# Altium schematic sheet Salida.SchDoc
size A4
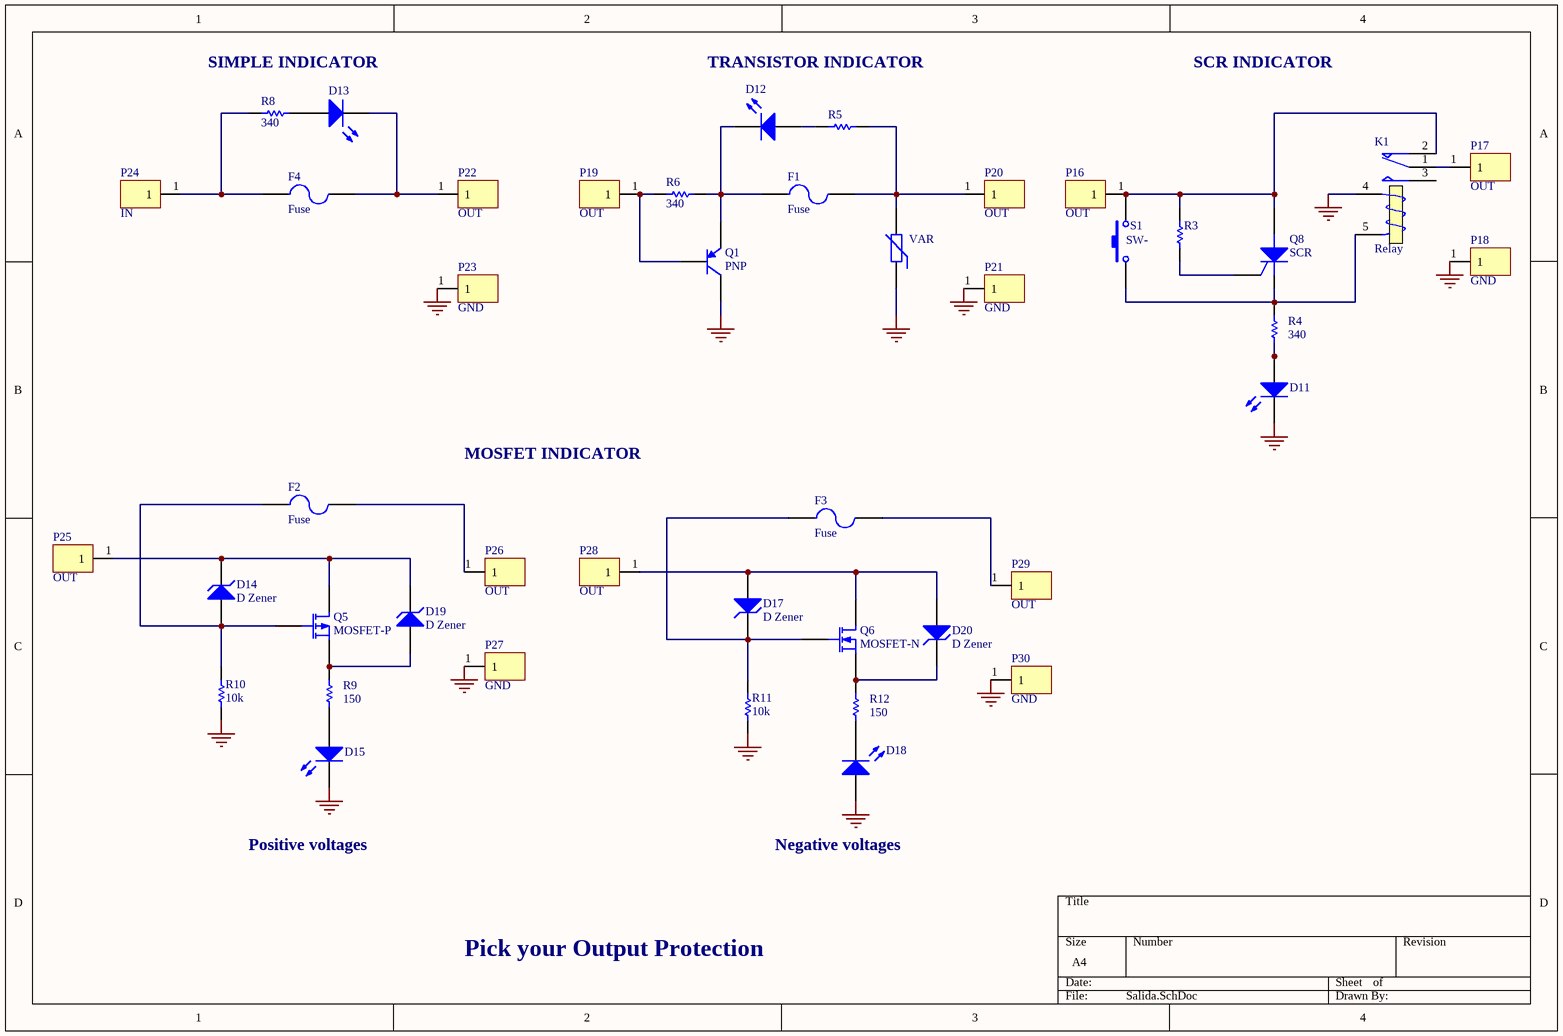
[diagram p0: Salida.SchDoc]

## Parts
D11  LED0  [LED-0]  (value not drawn)
D12  LED0  [LED-0]  (value not drawn)
D13  LED0  [LED-0]  (value not drawn)
D14  D Zener  [DIODE-0.7]
D15  LED0  [LED-0]  (value not drawn)
D17  D Zener  [DIODE-0.7]
D18  LED0  [LED-0]  (value not drawn)
D19  D Zener  [DIODE-0.7]
D20  D Zener  [DIODE-0.7]
F1  Fuse  [PIN-W2/E2.8]
F2  Fuse  [PIN-W2/E2.8]
F3  Fuse  [PIN-W2/E2.8]
F4  Fuse  [PIN-W2/E2.8]
K1  Relay  [MODULE5B]
P16  OUT  [cONECTOR]
P17  OUT  [cONECTOR]
P18  GND  [cONECTOR]
P19  OUT  [cONECTOR]
P20  OUT  [cONECTOR]
P21  GND  [cONECTOR]
P22  OUT  [cONECTOR]
P23  GND  [cONECTOR]
P24  IN  [cONECTOR]
P25  OUT  [cONECTOR]
P26  OUT  [cONECTOR]
P27  GND  [cONECTOR]
P28  OUT  [cONECTOR]
P29  OUT  [cONECTOR]
P30  GND  [cONECTOR]
Q1  PNP  [SOT-23B_N]
Q5  MOSFET-P  [E3]
Q6  MOSFET-N  [E3]
Q8  SCR  [TO-220-AB]
R3  Res1  [AXIAL-0.3]  (value not drawn)
R4  340  [AXIAL-0.3]
R5  340  [AXIAL-0.3]  (value not drawn)
R6  340  [AXIAL-0.3]
R8  340  [AXIAL-0.3]
R9  150  [AXIAL-0.3]
R10  10k  [AXIAL-0.3]
R11  10k  [AXIAL-0.3]
R12  150  [AXIAL-0.3]
S1  SW-  [SPST-2]
VAR  Res Varistor  [6-0805_N]  (value not drawn)

## Nets
GND: D11.2(K) D15.2(K) D18.1(A) K1.4(T1) P18.1 P21.1 P23.1 P27.1 P30.1 Q1.1(C) R10.1 R11.1 VAR.1
NetD11_1: D11.1(A) R4.1
NetD12_1: D12.1(A) R5.1
NetD12_2: D12.2(K) F1.1 Q1.3(E) R6.2
NetD13_1: D13.1(A) R8.1
NetD13_2: D13.2(K) F4.2 P22.1
NetD14_1: D14.1(A) F2.1 Q5.2(G) R10.2
NetD14_2: D14.2(K) D19.2(K) P25.1 Q5.1(D)
NetD15_1: D15.1(A) R9.1
NetD17_1: D17.1(A) D20.1(A) P28.1 Q6.1(D)
NetD17_2: D17.2(K) F3.1 Q6.2(G) R11.2
NetD18_2: D18.2(K) R12.1
NetD19_1: D19.1(A) Q5.3(S) R9.2
NetD20_2: D20.2(K) Q6.3(S) R12.2
NetF1_2: F1.2 P20.1 R5.2 VAR.2
NetF2_2: F2.2 P26.1
NetF3_2: F3.2 P29.1
NetF4_1: F4.1 P24.1 R8.2
NetK1_1: K1.1(COM) P17.1
NetK1_2: K1.2(NC) P16.1 Q8.1(A) R3.2 S1.2
NetK1_5: K1.5(T2) Q8.3(K) R4.2 S1.1
NetP19_1: P19.1 Q1.2(B) R6.1
NetQ8_2: Q8.2(G) R3.1

Not connected (* = marked no-connect by the designer): K1 3(NO)

## Notes on the sheet
- SIMPLE INDICATOR
- TRANSISTOR INDICATOR
- SCR INDICATOR
- MOSFET INDICATOR
- Positive voltages
- Negative voltages
- Pick your Output Protection

## Library data of the parts
D11-D13 D15 D18 = LED0: Typical INFRARED GaAs LED; Published: 8-Jun-2000; LatestRevisionDate: 08-Jul-2005; LatestRevisionNote: Mech Layer 1 removed.; PackageReference: LED-0; Publisher: Altium Limited; PackageDescription: LED; 2 Leads
D14 D17 D19 D20 = D Zener: Zener Diode; Published: 8-Jun-2000; LatestRevisionDate: 17-Jul-2002; LatestRevisionNote: Re-released for DXP Platform.; PackageReference: DIODE-0.7; Publisher: Altium Limited; PackageDescription: Diode, Thru-Hole; 2 Leads; 0.7 in Pin Spacing
F1-F4 = Fuse 2: Published: 8-Jun-2000; LatestRevisionDate: 17-Jul-2002; LatestRevisionNote: Re-released for DXP Platform.; PackageReference: PIN-W2/E2.8; Publisher: Altium Limited; PackageDescription: Thru-Hole; 2 Leads
K1 = Relay: SPDT Relay; Published: 8-Jun-2000; LatestRevisionDate: 17-Jul-2002; LatestRevisionNote: Re-released for DXP Platform.; PackageReference: MODULE5B; Publisher: Altium Limited
P16-P30 = Component_1
Q1 = PNP: PNP Bipolar Transistor; Published: 8-Jun-2000; LatestRevisionDate: 29-May-2009; LatestRevisionNote: IPC-7351 Footprint Added.; PackageVersion: Aug-1999; PackageReference: SOT-23B; Publisher: Altium Limited; PackageDescription: 3-Pin SOT-23 Package 0.95 mm Pitch, 2.4 mm Lead Span
Q5 = MOSFET-P: P-Channel MOSFET; Published: 8-Jun-2000; LatestRevisionDate: 17-Jul-2002; LatestRevisionNote: Re-released for DXP Platform.; PackageVersion: 1995/1996; PackageReference: E3; Publisher: Altium Limited; PackageDescription: TO, Flat Index; 3 In-Line, Axial Leads; Body Dia. 4.6mm; Lead Dia. 0.5 mm (max)
Q6 = MOSFET-N: N-Channel MOSFET; Published: 8-Jun-2000; LatestRevisionDate: 17-Jul-2002; LatestRevisionNote: Re-released for DXP Platform.; PackageVersion: 1995/1996; PackageReference: E3; Publisher: Altium Limited; PackageDescription: TO, Flat Index; 3 In-Line, Axial Leads; Body Dia. 4.6mm; Lead Dia. 0.5 mm (max)
Q8 = SCR: Silicon Controlled Rectifier; Published: 8-Jun-2000; LatestRevisionDate: 17-Jul-2002; LatestRevisionNote: Re-released for DXP Platform.; PackageReference: TO-220-AB; Publisher: Altium Limited; Code_JEDEC: TO-220-AB
R3-R6 R8-R12 = Res1: Resistor; Value: 33 5W; Published: 8-Jun-2000; LatestRevisionDate: 17-Jul-2002; LatestRevisionNote: Re-released for DXP Platform.; PackageReference: AXIAL-0.3; Publisher: Altium Limited; PackageDescription: Axial Device, Thru-Hole; 2 Leads; 0.3 in Pin Spacing
S1 = SW-PB: Switch; Published: 24-Mar-1999; LatestRevisionDate: 17-Jul-2002; LatestRevisionNote: Re-released for DXP Platform.; PackageReference: SPST-2; Publisher: Altium Limited; PackageDescription: Switch; 2 Leads
VAR = Res Varistor: Varistor (Voltage-Sensitive Resistor); Published: 24-Mar-1999; LatestRevisionDate: 29-May-2009; LatestRevisionNote: IPC-7351 Footprint Added.; PackageVersion: Mar-2003; PackageReference: 6-0805; Publisher: Altium Limited; PackageDescription: Chip Resistor 0805 Case Size; Code_IPC: RESC2012